# Altium schematic sheet BLDC_Motor_Reversal_Schematic.SchDoc
size A4; SheetNumber: 1; SheetTotal: 1
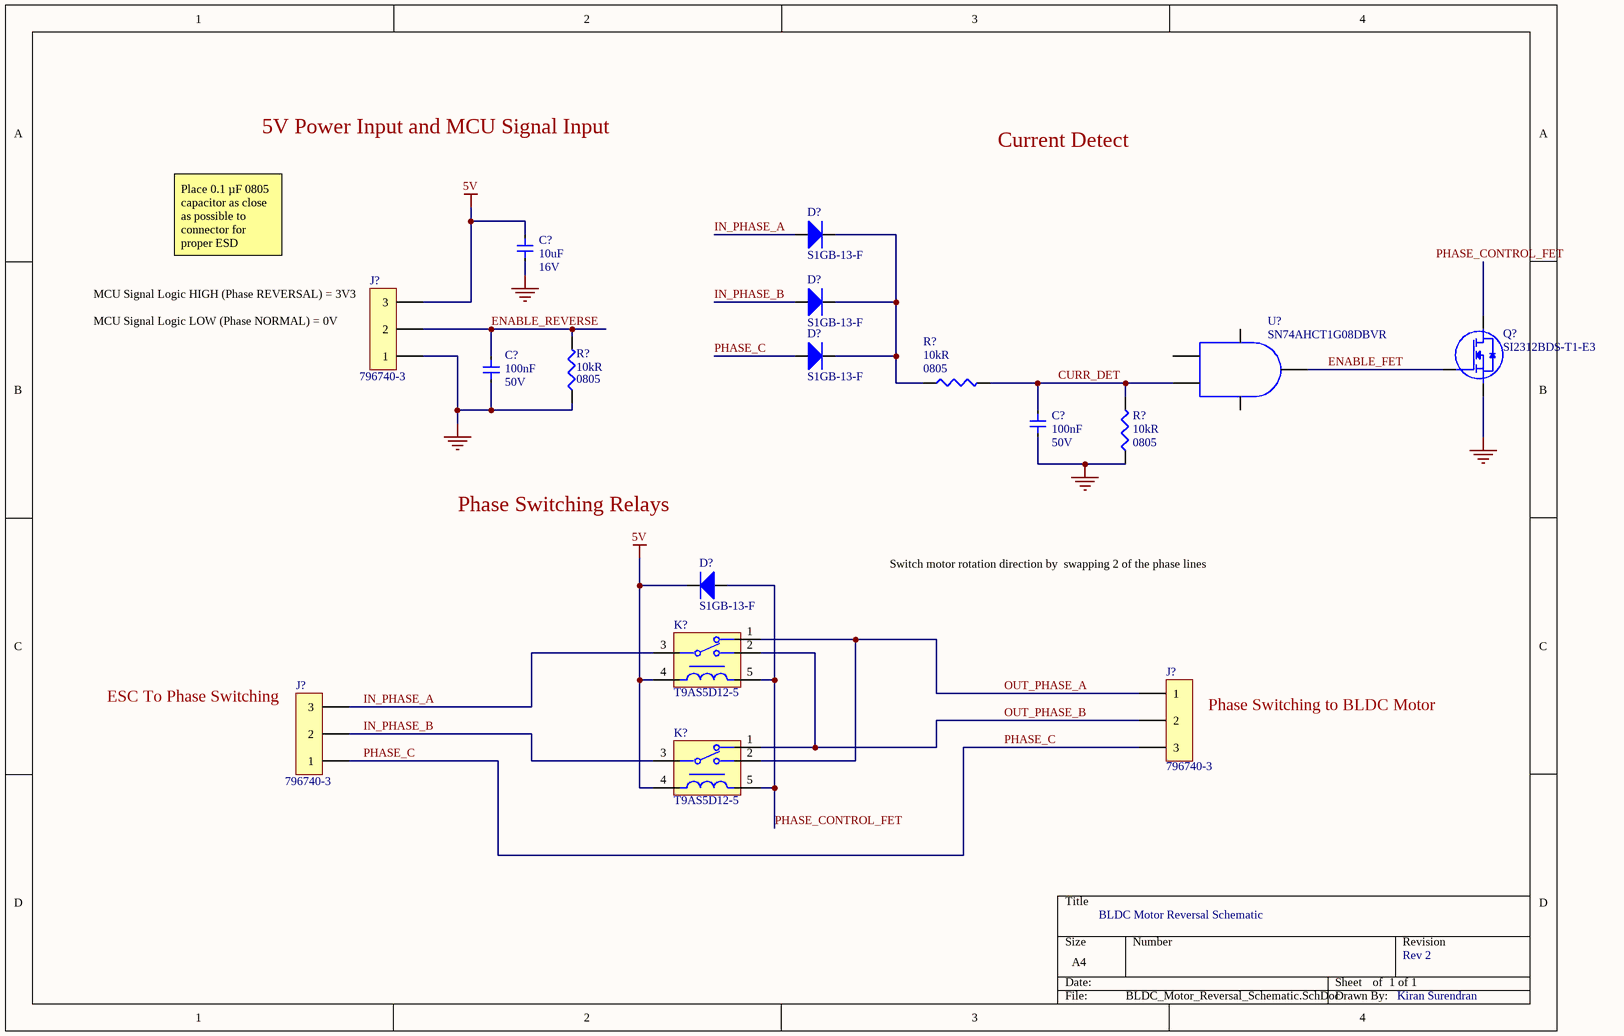
[diagram p0: BLDC_Motor_Reversal_Schematic.SchDoc]

## Parts
(Parts that share a designator on the sheet are numbered #1, #2 ... from top to bottom, then left to right.)
C?#1  Voltage Rating: 16V  Capacitance: 10uF  [C0805C106K4PACTU]  (hidden comment: C0805C106K4PACTU)
C?#2  Voltage Rating: 50V  Capacitance: 100nF  [C0805C104K5RACTU]  (hidden comment: C0805C104K5RACTU)
C?#3  Voltage Rating: 50V  Capacitance: 100nF  [C0805C104K5RACTU]  (hidden comment: C0805C104K5RACTU)
D?#1  S1GB-13-F  [S1GB-13-F]
D?#2  S1GB-13-F  [S1GB-13-F]
D?#3  S1GB-13-F  [S1GB-13-F]
D?#4  S1GB-13-F  [S1GB-13-F]
J?#1  796740-3  [796740-3]
J?#2  796740-3  [796740-3]
J?#3  796740-3  [796740-3]
K?#1  T9AS5D12-5  [T9AS5D12-5]
K?#2  T9AS5D12-5  [T9AS5D12-5]
Q?  SI2312BDS-T1-E3  [SI2312BDS-T1-E3]
R?#1  Package: 0805  Resistance: 10kR  [RC0805JR-0710KL]  (hidden comment: RC0805JR-0710KL)
R?#2  Package: 0805  Resistance: 10kR  [RC0805JR-0710KL]  (hidden comment: RC0805JR-0710KL)
R?#3  Package: 0805  Resistance: 10kR  [RC0805JR-0710KL]  (hidden comment: RC0805JR-0710KL)
U?  AND Gate  (value not drawn)

## Nets
5V: C?#1.2 D?#4.2(-) J?#1.3 K?#1.4 K?#2.4
GND: C?#1.1 C?#2.1 C?#3.1 J?#1.1 Q?.2(Source) R?#1.1 R?#3.1
CURR_DET: C?#3.2 R?#2.2 R?#3.2 U?.2(B)
ENABLE_FET: Q?.1(Gate) U?.4(Y)
ENABLE_REVERSE: C?#2.2 J?#1.2 R?#1.2
IN_PHASE_A: D?#1.1(+) J?#3.3 K?#1.3(COM)
IN_PHASE_B: D?#2.1(+) J?#3.2 K?#2.3(COM)
OUT_PHASE_A: J?#2.1 K?#1.1(NC) K?#2.2(NO)
OUT_PHASE_B: J?#2.2 K?#1.2(NO) K?#2.1(NC)
PHASE_C: D?#3.1(+) J?#2.3 J?#3.1
PHASE_CONTROL_FET: D?#4.1(+) K?#1.5 K?#2.5
NetD?#1_2: D?#1.2(-) D?#2.2(-) D?#3.2(-) R?#2.1

Not connected (* = marked no-connect by the designer): Q? 3(Drain); U? 1(A) 3(GND) 5(VCC)

## Notes on the sheet
- 5V Power Input and MCU Signal Input
- Current Detect
- Place 0.1 µF 0805 capacitor as close as possible to connector for proper ESD protection
- (near J?#1) MCU Signal Logic HIGH (Phase REVERSAL) = 3V3
- MCU Signal Logic LOW (Phase NORMAL) = 0V
- Phase Switching Relays
- Switch motor rotation direction by
  swapping 2 of the phase lines
- (near J?#3) ESC To Phase Switching
- (near J?#2) Phase Switching to BLDC Motor
- BLDC Motor Reversal Schematic
- 1 of 1
- Rev 2
- Kiran Surendran
- Labels drawn without touching a wire or pin: PHASE_CONTROL_FET

## Library data of the parts
C?#1 = C0805C106K4PACTU: CERAMIC CAPACITOR, 10UF, 16V, X5R, 10%, 0805; Manufacturer 1: KEMET; Supplier 1: Digi-Key; Supplier Part Number 1: 399-8012-1-ND; Manufacturer Part Number 1: C0805C106K4PACTU; Case/Package: 0805
C?#2 C?#3 = C0805C104K5RACTU: Cap Ceramic 0.1uF 50V X7R 10% SMD 2.0 x 1.2 mm 125 C Paper T/R; Manufacturer 1: KEMET; Manufacturer Part Number 1: C0805C104K5RACTU; Case/Package: 0805; Supplier 1: Digi-Key; Supplier Part Number 1: 399-1170-1-ND
D?#1-D?#4 = S1GB-13-F: Flyback Diode for SPDT; Manufacturer 1: Diodes Incorporated; VRRM: 325V; IFSM: 8.0A; Manufacturer Part Number 1: S1GB-13-F; Supplier 1: Digi-Key; Supplier Part Number 1: S1GB-FDICT-ND
J?#1-J?#3 = 796740-3: TERM BLK 3P SIDE ENT 6.35MM PCB; Manufacturer 1: TE Connectivity AMP Connectors; Supplier Part Number 1: A98276-ND; Manufacturer Part Number 1: 796740-3; Supplier 1: Digi-Key
K?#1 K?#2 = T9AS5D12-5: RELAY GEN PURPOSE SPDT 20A 5V; Manufacturer 1: TE Connectivity Potter & Brumfield Relays; Contact Voltage Rating (AC): 277V; Current Rating: 30A; Coil Current: 200mA; Voltage Rating (DC): 5V; Coil Voltage (DC): 5V; Contact Current Rating: 20A; Manufacturer Part Number 1: T9AS5D12-5; Supplier 1: Digi-Key; Supplier Part Number 1: T9AS5D12-5-ND
Q? = SI2312BDS-T1-E3: MOSFET; Manufacturer 1: Vishay Siliconix; Manufacturer Part Number 1: SI2312BDS-T1-E3; Supplier 1: Digi-Key; Supplier Part Number 1: SI2312BDS-T1-E3CT-ND
R?#1-R?#3 = RC0805JR-0710KL: Res Thick Film 0805 10K Ohm 5% 1/8W ±100ppm/°C Molded SMD Paper T/R; Manufacturer 1: Yageo; Supplier 1: Digi-Key; Supplier Part Number 1: 311-10KARCT-ND; Manufacturer Part Number 1: RC0805JR-0710KL; Tolerance: 5%
U? = SN74AHCT1G08DBVR: AND Gate IC 1 Channel - SOT-23-5; Manufacturer 1: Texas Instruments; Supplier Part Number 1: 296-1113-1-ND; Supplier 1: Digi-Key; Manufacturer Part Number 1: SN74AHCT1G08DBVR